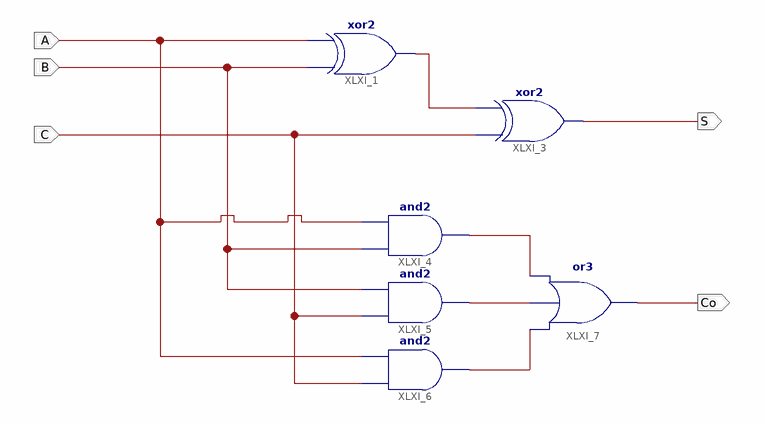
[diagram p0: schematic sheet 1]
// Xilinx ISE schematic Adder1b.sch (kintex7) as structural Verilog: 6 symbols, 5 ports
module Adder1b (
  input  B,
  input  C,
  input  A,
  output Co,
  output S
);

  wire XLXN_5, XLXN_13, XLXN_14, XLXN_15;

  xor XLXI_1 (XLXN_5, B, A);
  xor XLXI_3 (S, C, XLXN_5);
  and XLXI_4 (XLXN_13, B, A);
  and XLXI_5 (XLXN_14, C, B);
  and XLXI_6 (XLXN_15, C, A);
  or XLXI_7 (Co, XLXN_15, XLXN_14, XLXN_13);
endmodule
